# Altium schematic sheet Microcontroller.SchDoc: Microcontroller
size A4
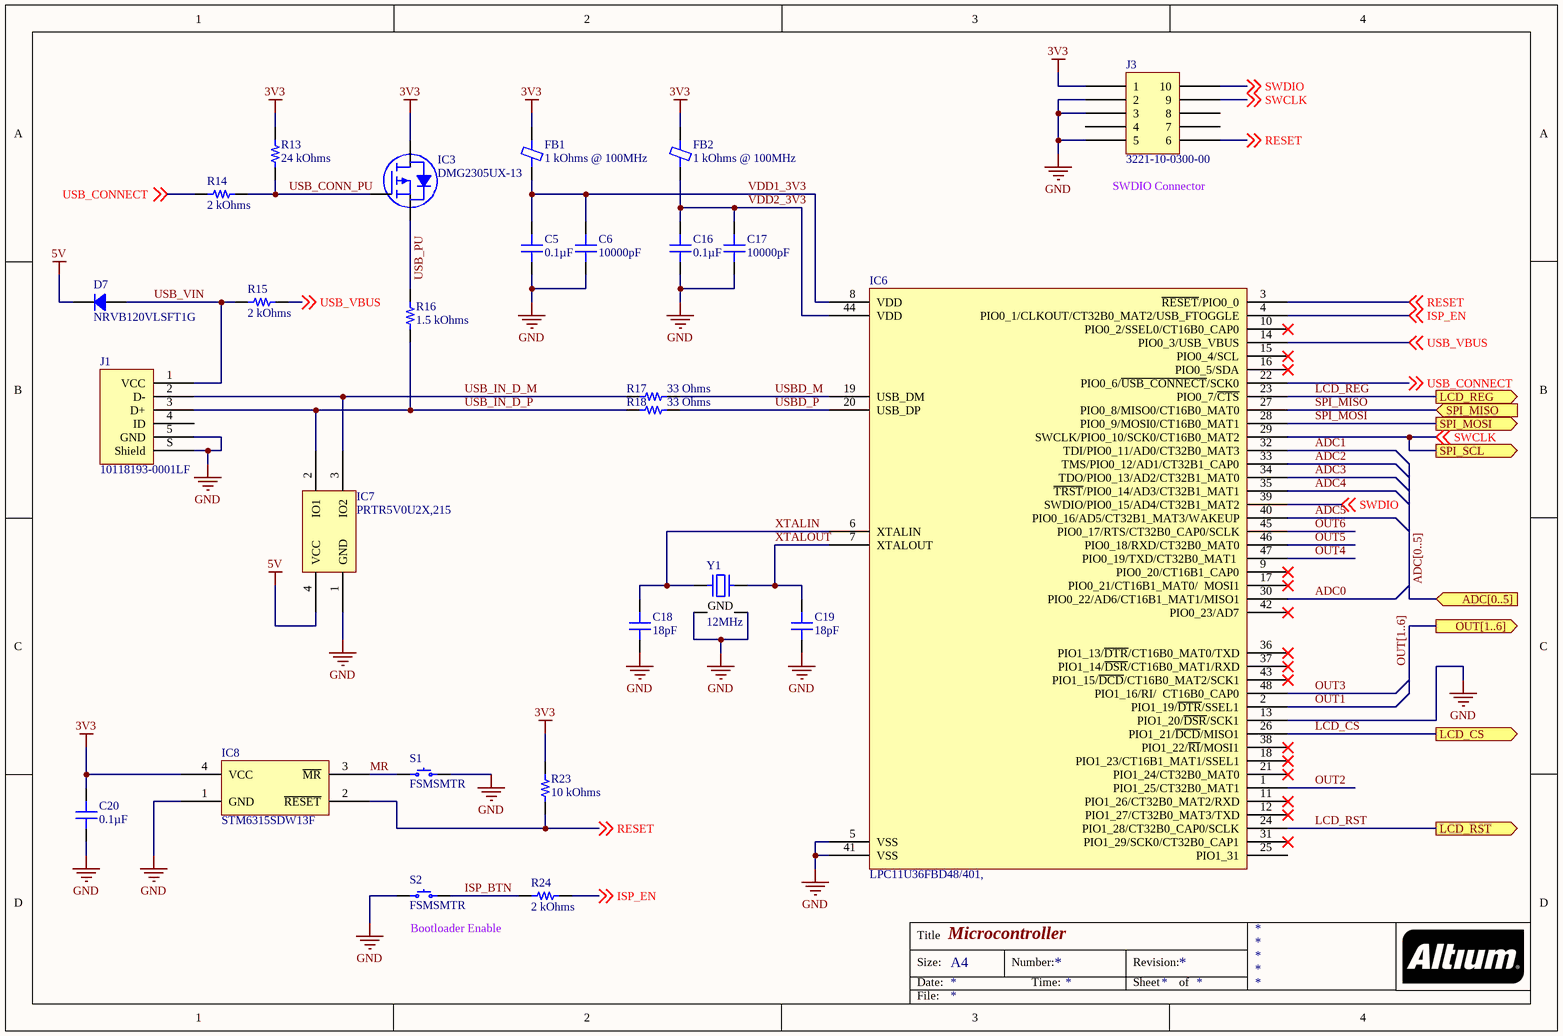
[diagram p0: Microcontroller.SchDoc]

## Parts
C5  0.1µF  [CAP 0603_1608]
C6  10000pF  [CAP 0603_1608]
C16  0.1µF  [CAP 0603_1608]
C17  10000pF  [CAP 0603_1608]
C18  18pF  [CAP 0603_1608]
C19  18pF  [CAP 0603_1608]
C20  0.1µF  [CAP 0603_1608]
D7  NRVB120VLSFT1G  [SOD123F]
FB1  1 kOhms @ 100MHz  [FER 0603_1608]
FB2  1 kOhms @ 100MHz  [FER 0603_1608]
IC3  DMG2305UX-13  [DIODES SOT-23-3]
IC6  LPC11U36FBD48/401,  [NXP LQFP-48 7X7MM]
IC7  PRTR5V0U2X,215  [SOT143B]
IC8  STM6315SDW13F  [ST SOT-143-4]
J1  10118193-0001LF  [FCI USB 10118193-0001LF]
J3  3221-10-0300-00  [CNC TECH 3221-10-0300-00]
R13  24 kOhms  [RES 0603_1608]
R14  2 kOhms  [RES 0603_1608]
R15  2 kOhms  [RES 0603_1608]
R16  1.5 kOhms  [RES 0603_1608]
R17  33 Ohms  [RES 0603_1608]
R18  33 Ohms  [RES 0603_1608]
R23  10 kOhms  [RES 0603_1608]
R24  2 kOhms  [RES 0603_1608]
S1  FSMSMTR  [TE FSMSMTR]
S2  FSMSMTR  [TE FSMSMTR]
Y1  12MHz  [ABRACON ABM8G]

## Ports
ADC[0..5] (in), LCD_CS (out), LCD_REG (out), LCD_RST (out), OUT[1..6] (out), SPI_MISO (in), SPI_MOSI (out), SPI_SCL (out)

## Nets
3V3: C20.2 FB1.2 FB2.2 IC3.3(D) IC8.4(VCC) J3.1 R13.2 R23.2
5V: D7.2 IC7.4(VCC)
GND: C5.1 C6.1 C16.1 C17.1 C18.1 C19.1 C20.1 IC6.5(VSS) IC6.13(PIO1_20/~{DSR}/SCK1) IC6.41(VSS) IC7.1(GND) IC8.1(GND) J1.5(GND) J1.S(Shield) J3.2 J3.3 J3.5 S1.2 S2.1 Y1.2(GND) Y1.4(GND)
ADC0: IC6.30(PIO0_22/AD6/CT16B1_MAT1/MISO1)
ADC1: IC6.32(TDI/PIO0_11/AD0/CT32B0_MAT3)
ADC2: IC6.33(TMS/PIO0_12/AD1/CT32B1_CAP0)
ADC3: IC6.34(TDO/PIO0_13/AD2/CT32B1_MAT0)
ADC4: IC6.35(~{TRST}/PIO0_14/AD3/CT32B1_MAT1)
ADC5: IC6.40(PIO0_16/AD5/CT32B1_MAT3/WAKEUP)
ISP_BTN: R24.1 S2.2
ISP_EN: IC6.4(PIO0_1/CLKOUT/CT32B0_MAT2/USB_FTOGGLE) R24.2 ; off-sheet ISP_EN
LCD_CS: IC6.26(PIO1_21/~{DCD}/MISO1) ; port LCD_CS
LCD_REG: IC6.23(PIO0_7/~{CTS}) ; port LCD_REG
LCD_RST: IC6.24(PIO1_28/CT32B0_CAP0/SCLK) ; port LCD_RST
MR: IC8.3(~{MR}) S1.1
OUT1: IC6.2(PIO1_19/~{DTR}/SSEL1)
OUT2: IC6.1(PIO1_25/CT32B0_MAT1)
OUT3: IC6.48(PIO1_16/RI/__CT16B0_CAP0)
OUT4: IC6.47(PIO0_19/TXD/CT32B0_MAT1)
OUT5: IC6.46(PIO0_18/RXD/CT32B0_MAT0)
OUT6: IC6.45(PIO0_17/RTS/CT32B0_CAP0/SCLK)
RESET: IC6.3(~{RESET}/PIO0_0) IC8.2(~{RESET}) J3.6 R23.1 ; off-sheet RESET
SPI_MISO: IC6.27(PIO0_8/MISO0/CT16B0_MAT0) ; port SPI_MISO
SPI_MOSI: IC6.28(PIO0_9/MOSI0/CT16B0_MAT1) ; port SPI_MOSI
SWCLK: IC6.29(SWCLK/PIO0_10/SCK0/CT16B0_MAT2) J3.9 ; off-sheet SWCLK, port SPI_SCL
SWDIO: IC6.39(SWDIO/PIO0_15/AD4/CT32B1_MAT2) J3.10 ; off-sheet SWDIO
USB_CONN_PU: IC3.1(G) R13.1 R14.2
USB_CONNECT: IC6.22(PIO0_6/~{USB_CONNECT}/SCK0) R14.1 ; off-sheet USB_CONNECT
USB_IN_D_M: IC7.3(IO2) J1.2(D-) R17.1
USB_IN_D_P: IC7.2(IO1) J1.3(D+) R16.1 R18.1
USB_PU: IC3.2(S) R16.2
USB_VBUS: IC6.14(PIO0_3/USB_VBUS) R15.2 ; off-sheet USB_VBUS
USB_VIN: D7.1 J1.1(VCC) R15.1
USBD_M: IC6.19(USB_DM) R17.2
USBD_P: IC6.20(USB_DP) R18.2
VDD1_3V3: C5.2 C6.2 FB1.1 IC6.8(VDD)
VDD2_3V3: C16.2 C17.2 FB2.1 IC6.44(VDD)
XTALIN: C18.2 IC6.6(XTALIN) Y1.1
XTALOUT: C19.2 IC6.7(XTALOUT) Y1.3

Not connected (* = marked no-connect by the designer): IC6 9(PIO0_20/CT16B1_CAP0)* 10(PIO0_2/SSEL0/CT16B0_CAP0)* 11(PIO1_26/CT32B0_MAT2/RXD)* 12(PIO1_27/CT32B0_MAT3/TXD)* 15(PIO0_4/SCL)* 16(PIO0_5/SDA)* 17(PIO0_21/CT16B1_MAT0/__MOSI1)* 18(PIO1_23/CT16B1_MAT1/SSEL1)* 21(PIO1_24/CT32B0_MAT0)* 25(PIO1_31) 31(PIO1_29/SCK0/CT32B0_CAP1)* 36(PIO1_13/~{DTR}/CT16B0_MAT0/TXD)* 37(PIO1_14/~{DSR}/CT16B0_MAT1/RXD)* 38(PIO1_22/~{RI}/MOSI1)* 42(PIO0_23/AD7)* 43(PIO1_15/~{DCD}/CT16B0_MAT2/SCK1)*; J1 4(ID); J3 4 7 8

## Buses and harness runs
bus ADC[0..5] = port ADC[0..5]
bus OUT[1..6] = port OUT[1..6]

## Notes on the sheet
- (near J3) SWDIO Connector
- Bootloader Enable
- Title
- Size:
- Date:
- A4
- Number:
- Time:
- Revision:
- Sheet
- of
- File:

## Library data of the parts
C5 C16 C20 = CS0603KRX7R7BB104: CAP CER 0.1UF 16V X7R 0603; Manufacturer: Yageo; Tolerance: ±10%; Part Number: CS0603KRX7R7BB104; Value: 0.1µF; Applications: Boardflex Sensitive; Capacitance: 0.1µF; ComponentLink1Description: Datasheet; ComponentLink1URL: http://www.yageo.com/NewPortal/yageodocoutput?fileName=/pdf/MLCC/UPY-ST_NPOX7R_16V-to-3KV_5.pdf; ComponentLink2Description: DigiKey Link; ComponentLink2URL: http://digikey.com/product-detail/en/yageo/CS0603KRX7R7BB104/311-3560-1-ND/7648487; Device Package: 0603 (1608 Metric); Features: Soft Termination; LastUpdated: 02/01/2020 00:02:08; Lifecycle Status: Active; Minimum Order: 1; Mounting Type: Surface Mount, MLCC; Operating Temperature: -55°C ~ 125°C; Package / Case: 0603 (1608 Metric); Packaging: ReReel; PartId: 2286; Part Status: Active; Price: 0.00; Series: CS; Size / Dimension: 0.063" L x 0.031" W (1.60mm x 0.80mm); Supplier 1: DigiKey; Supplier Part Number 1: 311-3560-1-ND; Temperature Coefficient: X7R; Thickness (Max): 0.037" (0.95mm); Voltage - Rated: 16V
C6 C17 = AC0603KPX7R9BB103: CAP CER 10000PF 50V X7R 0603; Manufacturer: Yageo; Tolerance: ±10%; Part Number: AC0603KPX7R9BB103; Value: 10000pF; Applications: Automotive; Capacitance: 10000pF; ComponentLink1Description: Datasheet; ComponentLink1URL: http://www.yageo.com/NewPortal/_en/search/productDocs.jsp?YageoPartNumber=AC0603KPX7R9BB103; ComponentLink2Description: DigiKey Link; ComponentLink2URL: http://digikey.com/product-detail/en/yageo/AC0603KPX7R9BB103/311-3284-1-ND/6643536; Device Package: 0603 (1608 Metric); LastUpdated: 21/01/2020 00:02:05; Lifecycle Status: Active; Minimum Order: 1; Mounting Type: Surface Mount, MLCC; Operating Temperature: -55°C ~ 125°C; Package / Case: 0603 (1608 Metric); Packaging: TapeAndReel; PartId: 5188; Part Status: Active; Price: 0.01; Ratings: AEC-Q200; Series: AC; Size / Dimension: 0.063" L x 0.031" W (1.60mm x 0.80mm); Supplier 1: DigiKey; Supplier Part Number 1: 311-3284-1-ND; Temperature Coefficient: X7R; Thickness (Max): 0.035" (0.90mm); Voltage - Rated: 50V
C18 C19 = C0603C180K5GACTU: CAP CER 18PF 50V C0G/NP0 0603; Manufacturer: KEMET; Temperature Coefficient: C0G, NP0; Tolerance: ±10%; Part Number: C0603C180K5GACTU; Value: 18pF; Applications: General Purpose; Capacitance: 18pF; ComponentLink1Description: Datasheet; ComponentLink1URL: https://api.kemet.com/component-edge/download/datasheet/C0603C180K5GACTU.pdf; ComponentLink2Description: DigiKey Link; ComponentLink2URL: http://digikey.com/product-detail/en/kemet/C0603C180K5GACTU/399-7866-1-ND/3471589; Device Package: 0603 (1608 Metric); Features: Low ESL; LastUpdated: 21/01/2020 00:02:05; Lifecycle Status: Active; Minimum Order: 1; Mounting Type: Surface Mount, MLCC; Operating Temperature: -55°C ~ 125°C; Package / Case: 0603 (1608 Metric); Packaging: TapeAndReel; PartId: 5275; Part Status: Active; Price: 0.01; Series: SMD Comm C0G; Size / Dimension: 0.063" L x 0.031" W (1.60mm x 0.80mm); Supplier 1: DigiKey; Supplier Part Number 1: 399-7866-1-ND; Thickness (Max): 0.034" (0.87mm); Voltage - Rated: 50V
D7 = NRVB120VLSFT1G: DIODE SCHOTTKY 20V 1A SOD123; Manufacturer: ON Semiconductor; Current - Reverse Leakage @ Vr: 15mA @ 20V; Speed: Fast Recovery =< 500ns, > 200mA (Io); Voltage - Forward (Vf) (Max) @ If: 300mV @ 1A; Part Number: NRVB120VLSFT1G; ComponentLink1Description: Datasheet; ComponentLink1URL: http://www.onsemi.com/pub/Collateral/MBR120VLSFT1-D.PDF; ComponentLink2Description: DigiKey Link; ComponentLink2URL: http://digikey.com/product-detail/en/on-semiconductor/NRVB120VLSFT1G/NRVB120VLSFT1GOSCT-ND/8538727; Current - Average Rectified (Io): 1A; Device Package: SOD-123F; Diode Type: Schottky; LastUpdated: 21/01/2020 02:43:37; Lifecycle Status: Active; Minimum Order: 1; Mounting Type: Surface Mount; Operating Temperature - Junction: -65°C ~ 125°C; Package / Case: SOD-123F; Packaging: TapeAndReel; PartId: 2453; Part Status: Active; Price: 0.15; Series: Automotive, AEC-Q101; Supplier 1: DigiKey; Supplier Part Number 1: NRVB120VLSFT1GOSCT-ND; Supplier Device Package: SOD-123FL; Voltage - DC Reverse (Vr) (Max): 20V
FB1 FB2 = FBTH1608HE102-T: FERRITE BEAD,HIGH CURRENT, 0603; Manufacturer: Taiyo Yuden; Current Rating (Max): 500mA; DC Resistance (DCR) (Max): 350mOhm; Filter Type: Power Line; Number of Lines: 1; Part Number: FBTH1608HE102-T; ComponentLink1Description: Datasheet; ComponentLink1URL: https://ds.yuden.co.jp/TYCOMPAS/ut/detail?pn=FBTH1608HE102-T&u=M; ComponentLink2Description: DigiKey Link; ComponentLink2URL: http://digikey.com/product-detail/en/taiyo-yuden/FBTH1608HE102-T/587-6587-1-ND/10324935; Device Package: 0603 (1608 Metric); Height (Max): 0.037" (0.95mm); Impedance @ Frequency: 1 kOhms @ 100MHz; LastUpdated: 21/01/2020 02:28:14; Lifecycle Status: Active; Minimum Order: 1; Mounting Type: Surface Mount; Operating Temperature: -40°C ~ 150°C; Package / Case: 0603 (1608 Metric); Packaging: TapeAndReel; PartId: 702; Part Status: Active; Price: 0.09; Ratings: AEC-Q200; Series: FB; Size / Dimension: 0.063" L x 0.031" W (1.60mm x 0.80mm); Supplier 1: DigiKey; Supplier Part Number 1: 587-6587-1-ND; Value: 1 kOhms @ 100MHz
IC3 = DMG2305UX-13: MOSFET P-CH 20V 4.2A SOT23; Manufacturer: Diodes Incorporated; Current - Continuous Drain (Id) @ 25°C: 4.2A (Ta); Drive Voltage (Max Rds On,  Min Rds On): 1.8V, 4.5V; FET Type: P-Channel; Gate Charge (Qg) (Max) @ Vgs: 10.2nC @ 4.5V; Input Capacitance (Ciss) (Max) @ Vds: 808pF @ 15V; Power Dissipation (Max): 1.4W (Ta); Rds On (Max) @ Id, Vgs: 52mOhm @ 4.2A, 4.5V; Vgs (Max): ±8V; Vgs(th) (Max) @ Id: 900mV @ 250µA; Part Number: DMG2305UX-13; ComponentLink1Description: Datasheet; ComponentLink1URL: https://www.diodes.com/assets/Datasheets/DMG2305UX.pdf; ComponentLink2Description: DigiKey Link; ComponentLink2URL: http://digikey.com/product-detail/en/diodes-incorporated/DMG2305UX-13/DMG2305UX-13DICT-ND/4251589; Device Package: TO-236-3, SC-59, SOT-23-3; Drain to Source Voltage (Vdss): 20V; LastUpdated: 21/01/2020 04:00:37; Lifecycle Status: Active; Minimum Order: 1; Mounting Type: Surface Mount; Operating Temperature: -55°C ~ 150°C (TJ); Package / Case: TO-236-3, SC-59, SOT-23-3; Packaging: TapeAndReel; Part Status: Active; Price: 0.05; Series: -; Supplier 1: DigiKey; Supplier Part Number 1: DMG2305UX-13DICT-ND; Supplier Device Package: SOT-23; Technology: MOSFET (Metal Oxide)
IC6 = LPC11U36FBD48/401,: IC MCU 32BIT 96KB FLASH 48LQFP; Manufacturer: NXP USA Inc.; Connectivity: I²C, Microwire, SmartCard, SPI, SSP, UART/USART, USB; Core Processor: ARM® Cortex®-M0; Core Size: 32-Bit; Data Converters: A/D 8x10b; EEPROM Size: 4K x 8; Number of I/O: 40; Oscillator Type: Internal; Peripherals: Brown-out Detect/Reset, POR, WDT; Program Memory Size: 96KB (96K x 8); RAM Size: 10K x 8; Speed: 50MHz; Voltage - Supply (Vcc/Vdd): 1.8V ~ 3.6V; Part Number: LPC11U36FBD48/401,; ComponentLink1Description: Datasheet; ComponentLink1URL: https://www.nxp.com/docs/en/data-sheet/LPC11U3X.pdf; ComponentLink2Description: DigiKey Link; ComponentLink2URL: //digikey.com/product-detail/en/nxp-usa-inc/LPC11U36FBD48-401/568-9587-ND/3462840; Device Package: 48-LQFP; LastUpdated: 03/12/2019 15:42:55; Lifecycle Status: 0; Minimum Order: 1; Mounting Type: Surface Mount; Operating Temperature: -40°C ~ 85°C (TA); Package / Case: 48-LQFP; Packaging: Tray; PartId: 24; Part Status: Active; Price: 5.04; Program Memory Type: FLASH; Series: LPC11Uxx; Supplier 1: DigiKey; Supplier Part Number 1: 568-9587-ND; Supplier Device Package: 48-LQFP (7x7)
IC7 = PRTR5V0U2X,215: TVS DIODE 5.5V SOT143B; Manufacturer: Nexperia USA Inc.; Capacitance @ Frequency: 1pF @ 1MHz; Power Line Protection: Yes; Unidirectional Channels: 2; Voltage - Breakdown (Min): 6V; Voltage - Reverse Standoff (Typ): 5.5V (Max); Part Number: PRTR5V0U2X,215; Applications: General Purpose; ComponentLink1Description: Datasheet; ComponentLink1URL: https://assets.nexperia.com/documents/data-sheet/PRTR5V0U2X.pdf; ComponentLink2Description: DigiKey Link; ComponentLink2URL: //digikey.com/product-detail/en/nexperia-usa-inc/PRTR5V0U2X215/1727-3884-2-ND/1163690; Device Package: TO-253-4, TO-253AA; LastUpdated: 09/12/2019 21:29:05; Lifecycle Status: 0; Minimum Order: 1; Mounting Type: Surface Mount; Operating Temperature: -40°C ~ 85°C (TA); Package / Case: TO-253-4, TO-253AA; Packaging: TapeAndReel; PartId: 5451; Part Status: Active; Price: 0.18; Series: -; Supplier 1: DigiKey; Supplier Part Number 1: 1727-3884-2-ND; Supplier Device Package: SOT-143B; Type: Steering (Rail to Rail)
IC8 = STM6315SDW13F: IC SUPERVISOR 1 CHANNEL SOT143-4; Manufacturer: STMicroelectronics; Number of Voltages Monitored: 1; Output: Open Drain or Open Collector; Reset: Active Low; Reset Timeout: 112ms Minimum; Voltage - Threshold: 2.93V; Part Number: STM6315SDW13F; ComponentLink1Description: Datasheet; ComponentLink1URL: http://www.st.com/content/ccc/resource/technical/document/datasheet/64/6b/44/43/61/e6/41/d5/CD00081393.pdf/files/CD00081393.pdf/jcr:content/translations/en.CD00081393.pdf; ComponentLink2Description: DigiKey Link; ComponentLink2URL: http://digikey.com/product-detail/en/stmicroelectronics/STM6315SDW13F/497-4975-1-ND/1003446; Device Package: TO-253-4, TO-253AA; LastUpdated: 21/01/2020 03:59:26; Lifecycle Status: Active; Minimum Order: 1; Mounting Type: Surface Mount; Operating Temperature: -40°C ~ 125°C (TA); Package / Case: TO-253-4, TO-253AA; Packaging: TapeAndReel; Part Status: Active; Price: 0.23; Series: -; Supplier 1: DigiKey; Supplier Part Number 1: 497-4975-1-ND; Supplier Device Package: SOT-143-4; Type: Simple Reset/Power-On Reset
J1 = 10118193-0001LF: CONN RCPT USB2.0 MICRO B SMD R/A; Manufacturer: Amphenol ICC (FCI); Connector Type: USB - micro B; Current Rating (Amps): 1.8A per Contact; Gender: Receptacle; Mating Cycles: 10000; Number of Contacts: 5; Number of Ports: 1; Shielding: Shielded; Voltage - Rated: 100VAC; Part Number: 10118193-0001LF; ComponentLink1Description: Datasheet; ComponentLink1URL: https://cdn.amphenol-icc.com/media/wysiwyg/files/documentation/datasheet/inputoutput/io_usb_micro.pdf; ComponentLink2Description: DigiKey Link; ComponentLink2URL: //digikey.com/product-detail/en/amphenol-icc-fci/10118193-0001LF/609-4616-2-ND/2785388; Features: Solder Retention; LastUpdated: 09/12/2019 20:51:28; Lifecycle Status: 0; Minimum Order: 1; Mounting Feature: Horizontal; Mounting Type: Surface Mount, Right Angle; Through Hole; Operating Temperature: -30°C ~ 80°C; Packaging: TapeAndReel; Part Status: Active; Price: 0.21; Series: -; Specifications: USB 2.0; Supplier 1: DigiKey; Supplier Part Number 1: 609-4616-2-ND; Termination: Solder
J3 = 3221-10-0300-00: CONN HEADER SMD 10POS 1.27MM; Manufacturer: CNC Tech; Current Rating (Amps): 1A; Material Flammability Rating: UL94 V-0; Number of Positions: 10; Number of Positions Loaded: All; Pitch - Mating: 0.050" (1.27mm); Shrouding: Shrouded - 4 Wall; Style: Board to Cable/Wire; Part Number: 3221-10-0300-00; ComponentLink1Description: Datasheet; ComponentLink1URL: http://cnctech.us/idcmatching2.pdf; ComponentLink2Description: DigiKey Link; ComponentLink2URL: http://digikey.com/product-detail/en/cnc-tech/3221-10-0300-00/1175-1735-ND/4878946; Connector Type: Header; Contact Finish - Mating: Gold; Contact Finish - Post: Gold; Contact Finish Thickness - Mating: Flash; Contact Material: Brass; Contact Shape: Square; Contact Type: Male Pin; Fastening Type: Push-Pull; Features: Keying Slot; Insulation Height: 0.213" (5.40mm); Insulation Material: Polyamide (PA6T), Nylon 6T; LastUpdated: 13/01/2020 00:09:21; Lifecycle Status: Active; Minimum Order: 1; Mounting Type: Surface Mount; Number of Rows: 2; Operating Temperature: -40°C ~ 105°C; Packaging: Tray; PartId: 109; Part Status: Active; Price: 0.73; Row Spacing - Mating: 0.050" (1.27mm); Series: -; Supplier 1: DigiKey; Supplier Part Number 1: 1175-1735-ND; Termination: Solder
R13 = ERJ-3EKF2402V: RES SMD 24K OHM 1% 1/10W 0603; Manufacturer: Panasonic Electronic Components; Power (Watts): 0.1W, 1/10W; Temperature Coefficient: ±100ppm/°C; Part Number: ERJ-3EKF2402V; Value: 24 kOhms; ComponentLink1Description: Datasheet; ComponentLink1URL: https://industrial.panasonic.com/cdbs/www-data/pdf/RDA0000/AOA0000C304.pdf; ComponentLink2Description: DigiKey Link; ComponentLink2URL: http://digikey.com/product-detail/en/panasonic-electronic-components/ERJ-3EKF2402V/P24.0KHCT-ND/1746748; Composition: Thick Film; Device Package: 0603 (1608 Metric); Features: Automotive AEC-Q200; Height - Seated (Max): 0.022" (0.55mm); LastUpdated: 21/01/2020 00:17:12; Lifecycle Status: Active; Minimum Order: 1; Number of Terminations: 2; Operating Temperature: -55°C ~ 155°C; Package / Case: 0603 (1608 Metric); Packaging: TapeAndReel; PartId: 23079; Part Status: Active; Price: 0.01; Ratings: AEC-Q200; Resistance: 24 kOhms; Series: ERJ; Size / Dimension: 0.063" L x 0.031" W (1.60mm x 0.80mm); Supplier 1: DigiKey; Supplier Part Number 1: P24.0KHCT-ND; Supplier Device Package: 0603; Tolerance: ±1%
R14 = ERJ-3EKF2001V: RES SMD 2K OHM 1% 1/10W 0603; Manufacturer: Panasonic Electronic Components; Power (Watts): 0.1W, 1/10W; Temperature Coefficient: ±100ppm/°C; Part Number: ERJ-3EKF2001V; Value: 2 kOhms; ComponentLink1Description: Datasheet; ComponentLink1URL: https://industrial.panasonic.com/cdbs/www-data/pdf/RDA0000/AOA0000C304.pdf; ComponentLink2Description: DigiKey Link; ComponentLink2URL: http://digikey.com/product-detail/en/panasonic-electronic-components/ERJ-3EKF2001V/P2.00KHCT-ND/198219; Composition: Thick Film; Device Package: 0603 (1608 Metric); Features: Automotive AEC-Q200; Height - Seated (Max): 0.022" (0.55mm); LastUpdated: 21/01/2020 00:14:57; Lifecycle Status: Active; Minimum Order: 1; Number of Terminations: 2; Operating Temperature: -55°C ~ 155°C; Package / Case: 0603 (1608 Metric); Packaging: TapeAndReel; PartId: 25697; Part Status: Active; Price: 0.01; Ratings: AEC-Q200; Resistance: 2 kOhms; Series: ERJ; Size / Dimension: 0.063" L x 0.031" W (1.60mm x 0.80mm); Supplier 1: DigiKey; Supplier Part Number 1: P2.00KHCT-ND; Supplier Device Package: 0603; Tolerance: ±1%
R15 R24 = ERJ-PA3J202V: RES SMD 2K OHM 5% 1/4W 0603; Manufacturer: Panasonic Electronic Components; Power (Watts): 0.25W, 1/4W; Temperature Coefficient: ±200ppm/°C; Part Number: ERJ-PA3J202V; Value: 2 kOhms; ComponentLink1Description: Datasheet; ComponentLink1URL: https://industrial.panasonic.com/cdbs/www-data/pdf/RDO0000/AOA0000C331.pdf; ComponentLink2Description: DigiKey Link; ComponentLink2URL: http://digikey.com/product-detail/en/panasonic-electronic-components/ERJ-PA3J202V/P2KBZCT-ND/5036279; Composition: Thick Film; Device Package: 0603 (1608 Metric); Features: Automotive AEC-Q200, Pulse Withstanding; Height - Seated (Max): 0.022" (0.55mm); LastUpdated: 21/01/2020 00:23:23; Lifecycle Status: Active; Minimum Order: 1; Number of Terminations: 2; Operating Temperature: -55°C ~ 155°C; Package / Case: 0603 (1608 Metric); Packaging: TapeAndReel; PartId: 8961; Part Status: Active; Price: 0.01; Ratings: AEC-Q200; Resistance: 2 kOhms; Series: ERJ; Size / Dimension: 0.063" L x 0.031" W (1.60mm x 0.80mm); Supplier 1: DigiKey; Supplier Part Number 1: P2KBZCT-ND; Supplier Device Package: 0603; Tolerance: ±5%
R16 = ERJ-3EKF1501V: RES SMD 1.5K OHM 1% 1/10W 0603; Manufacturer: Panasonic Electronic Components; Power (Watts): 0.1W, 1/10W; Temperature Coefficient: ±100ppm/°C; Part Number: ERJ-3EKF1501V; Value: 1.5 kOhms; ComponentLink1Description: Datasheet; ComponentLink1URL: https://industrial.panasonic.com/cdbs/www-data/pdf/RDA0000/AOA0000C304.pdf; ComponentLink2Description: DigiKey Link; ComponentLink2URL: http://digikey.com/product-detail/en/panasonic-electronic-components/ERJ-3EKF1501V/P1.50KHCT-ND/198088; Composition: Thick Film; Device Package: 0603 (1608 Metric); Features: Automotive AEC-Q200; Height - Seated (Max): 0.022" (0.55mm); LastUpdated: 21/01/2020 00:24:38; Lifecycle Status: Active; Minimum Order: 1; Number of Terminations: 2; Operating Temperature: -55°C ~ 155°C; Package / Case: 0603 (1608 Metric); Packaging: TapeAndReel; PartId: 5637; Part Status: Active; Price: 0.01; Ratings: AEC-Q200; Resistance: 1.5 kOhms; Series: ERJ; Size / Dimension: 0.063" L x 0.031" W (1.60mm x 0.80mm); Supplier 1: DigiKey; Supplier Part Number 1: P1.50KHCT-ND; Supplier Device Package: 0603; Tolerance: ±1%
R17 R18 = ERJ-3EKF33R0V: RES SMD 33 OHM 1% 1/10W 0603; Manufacturer: Panasonic Electronic Components; Power (Watts): 0.1W, 1/10W; Temperature Coefficient: ±100ppm/°C; Part Number: ERJ-3EKF33R0V; Value: 33 Ohms; ComponentLink1Description: Datasheet; ComponentLink1URL: https://industrial.panasonic.com/cdbs/www-data/pdf/RDA0000/AOA0000C304.pdf; ComponentLink2Description: DigiKey Link; ComponentLink2URL: http://digikey.com/product-detail/en/panasonic-electronic-components/ERJ-3EKF33R0V/P33.0HCT-ND/1746765; Composition: Thick Film; Device Package: 0603 (1608 Metric); Features: Automotive AEC-Q200; Height - Seated (Max): 0.022" (0.55mm); LastUpdated: 21/01/2020 00:24:38; Lifecycle Status: Active; Minimum Order: 1; Number of Terminations: 2; Operating Temperature: -55°C ~ 155°C; Package / Case: 0603 (1608 Metric); Packaging: TapeAndReel; PartId: 5660; Part Status: Active; Price: 0.01; Ratings: AEC-Q200; Resistance: 33 Ohms; Series: ERJ; Size / Dimension: 0.063" L x 0.031" W (1.60mm x 0.80mm); Supplier 1: DigiKey; Supplier Part Number 1: P33.0HCT-ND; Supplier Device Package: 0603; Tolerance: ±1%
R23 = ERJ-3EKF1002V: RES SMD 10K OHM 1% 1/10W 0603; Manufacturer: Panasonic Electronic Components; Power (Watts): 0.1W, 1/10W; Temperature Coefficient: ±100ppm/°C; Part Number: ERJ-3EKF1002V; Value: 10 kOhms; ComponentLink1Description: Datasheet; ComponentLink1URL: https://industrial.panasonic.com/cdbs/www-data/pdf/RDA0000/AOA0000C304.pdf; ComponentLink2Description: DigiKey Link; ComponentLink2URL: http://digikey.com/product-detail/en/panasonic-electronic-components/ERJ-3EKF1002V/P10.0KHCT-ND/198102; Composition: Thick Film; Device Package: 0603 (1608 Metric); Features: Automotive AEC-Q200; Height - Seated (Max): 0.022" (0.55mm); LastUpdated: 21/01/2020 00:14:57; Lifecycle Status: Active; Minimum Order: 1; Number of Terminations: 2; Operating Temperature: -55°C ~ 155°C; Package / Case: 0603 (1608 Metric); Packaging: TapeAndReel; PartId: 25695; Part Status: Active; Price: 0.01; Ratings: AEC-Q200; Resistance: 10 kOhms; Series: ERJ; Size / Dimension: 0.063" L x 0.031" W (1.60mm x 0.80mm); Supplier 1: DigiKey; Supplier Part Number 1: P10.0KHCT-ND; Supplier Device Package: 0603; Tolerance: ±1%
S1 S2 = FSMSMTR: SWITCH TACTILE SPST-NO 0.05A 24V; Manufacturer: TE Connectivity ALCOSWITCH Switches; Actuator Height off PCB, Vertical: 4.57mm; Actuator Orientation: Top Actuated; Actuator Type: Standard; Contact Rating @ Voltage: 0.05A @ 24VDC; Illumination: Non-Illuminated; Operating Force: 180gf; Outline: 6.00mm x 3.50mm; Switch Function: Off-Mom; Part Number: FSMSMTR; Circuit: SPST-NO; ComponentLink1Description: Datasheet; ComponentLink1URL: https://www.te.com/commerce/DocumentDelivery/DDEController?Action=srchrtrv&DocNm=1437566-3&DocType=Customer+Drawing&DocLang=English; ComponentLink2Description: DigiKey Link; ComponentLink2URL: http://digikey.com/product-detail/en/te-connectivity-alcoswitch-switches/FSMSMTR/450-1758-1-ND/2271637; LastUpdated: 25/01/2020 20:03:55; Lifecycle Status: Active; Minimum Order: 1; Mounting Type: Surface Mount; Operating Temperature: -35°C ~ 85°C; Packaging: TapeAndReel; Part Status: Active; Price: 0.19; Series: FSMSM; Supplier 1: DigiKey; Supplier Part Number 1: 450-1758-1-ND; Termination Style: Gull Wing
Y1 = ABM8G-106-12.000MHZ-T: IOT 12MHZ 10PF XTAL; Manufacturer: Abracon LLC; ESR (Equivalent Series Resistance): 120 Ohms; Frequency Stability: ±30ppm; Frequency Tolerance: ±20ppm; Operating Mode: Fundamental; Part Number: ABM8G-106-12.000MHZ-T; ComponentLink1Description: Datasheet; ComponentLink1URL: https://abracon.com/datasheets/ABM8G-106-12.000MHz-T.pdf; ComponentLink2Description: DigiKey Link; ComponentLink2URL: http://digikey.com/product-detail/en/abracon-llc/ABM8G-106-12.000MHZ-T/535-14512-1-ND/8827203; Device Package: 4-SMD, No Lead; Frequency: 12MHz; Height - Seated (Max): 0.039" (1.00mm); LastUpdated: 15/01/2020 00:15:56; Lifecycle Status: Active; Load Capacitance: 10pF; Minimum Order: 1; Mounting Type: Surface Mount; Operating Temperature: -40°C ~ 85°C; Package / Case: 4-SMD, No Lead; Packaging: TapeAndReel; PartId: 308; Part Status: Active; Price: 0.26; Series: ABM8G; Size / Dimension: 0.126" L x 0.098" W (3.20mm x 2.50mm); Supplier 1: DigiKey; Supplier Part Number 1: 535-14512-1-ND; Type: MHz Crystal; Value: 12MHz